# EAGLE design piezo-preamp-tickler_V0-5 (EAGLE 7.5.0)
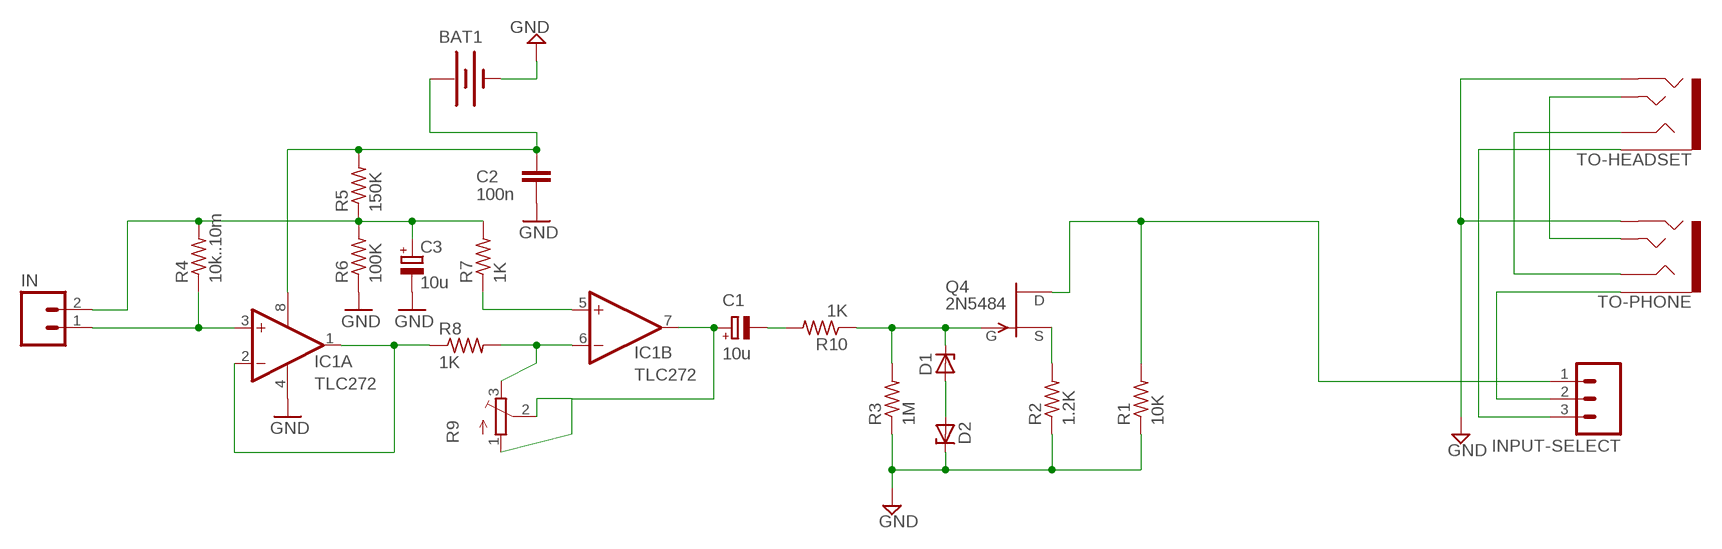
[diagram p0: schematic, sheet 1]

## Parts
BAT1  BATTERYA23  [BATTERY-A23]
C1  10u  CPOL-EUE2.5-5  [E2,5-5]
C2  100n  C-EU025-025X050  [C025-025X050]
C3  10u  CPOL-EUE2.5-5  [E2,5-5]
D1  1N821  [DO35Z10]
D2  1N821  [DO35Z10]
IC1  TLC272  TLC272P  [DIL08]
IN  M02LOCK  [1X02_LOCK]
INPUT-SELECT  M03LOCK  [1X03_LOCK]
Q4  2N5484  [TO92-]
R1  10K  R-US_0204/2V  [0204V]
R2  1.2K  R-US_0204/2V  [0204V]
R3  1M  R-US_0204/2V  [0204V]
R4  10k..10m  R-US_0204/2V  [0204V]
R5  150K  R-US_0204/2V  [0204V]
R6  100K  R-US_0204/2V  [0204V]
R7  1K  R-US_0204/2V  [0204V]
R8  1K  R-US_0204/2V  [0204V]
R9  TRIMPOT3386  [TRIM-3386]
R10  1K  R-US_0204/2V  [0204V]
TO-HEADSET  AUDIO-JACK3  [AUDIO-JACK-TRRS-SMD]
TO-PHONE  AUDIO-JACK3  [AUDIO-JACK-TRRS-SMD]

## Nets
`DEL: INPUT-SELECT.1 Q4.3(D) R1.2
GND: BAT1.GND@1(-) C2.1 C3.- D2.C IC1.4(P:V-) R1.1 R2.1 R3.1 R6.1 TO-HEADSET.RING2 TO-PHONE.RING2
N$1: D1.A D2.A
N$3: Q4.2(S) R2.2
N$5: IC1.5(B:+IN) R7.1
N$6: C1.+ IC1.7(B:OUT) R9.1(A) R9.2(S)
N$7: IC1.6(B:-IN) R8.2 R9.3(E)
N$8: C3.+ IN.2 R4.2 R5.1 R6.2 R7.2
N$9: IC1.3(A:+IN) IN.1 R4.1
N$10: D1.C Q4.1(G) R3.2 R10.1
N$11: C1.- R10.2
N$12: INPUT-SELECT.3 TO-HEADSET.EARTH
N$13: TO-HEADSET.TIP TO-PHONE.TIP
N$14: IC1.1(A:OUT) IC1.2(A:-IN) R8.1
N$15: TO-HEADSET.RING1 TO-PHONE.RING1
TO-PHONE: INPUT-SELECT.2 TO-PHONE.EARTH
V9V: BAT1.PWR@1(+) C2.2 IC1.8(P:V+) R5.2

## Library data of the parts
BAT1 = Daniel:BATTERY: Battery Holders Various common sizes : AA, AAA, 18650 (PRT-12895), 20mm coin cell and 12mm coin cell. 20MM_4LEGS, BATT-10373
C1 C3 = rcl:CPOL-EU: POLARIZED CAPACITOR, European symbol
C2 = rcl:C-EU: CAPACITOR, European symbol
D1 D2 = diode:1N821: Reference DIODE temperature compensated, 6,2 V
IC1 = linear:TLC272: OP AMP
IN = SparkFun-Connectors:M02: Header 2 Standard 2-pin 0.1" header. Use with straight break away headers (SKU : PRT-00116), right angle break away headers (PRT-00553), swiss pins (PRT-00743), machine pins (PRT-00117), and female headers (PRT-00115). Molex polarized connector foot print use with SKU : PRT-08233 with associated crimp pins and housings.
INPUT-SELECT = SparkFun-Connectors:M03: Header 3 Standard 3-pin 0.1" header. Use with straight break away headers (SKU : PRT-00116), right angle break away headers (PRT-00553), swiss pins (PRT-00743), machine pins (PRT-00117), and female headers (PRT-00115). Molex polarized connector foot print use with SKU : PRT-08232 with associated crimp pins and housings.
Q4 = transistor-fet:?548*: N-Channel JFETs Source: VISHAY 2N5484.pdf Compatible: TO92 2N5245 J304 J305 U310 J308 J309 J310 TO72 2N4416 2N4416A 2N3823 2N4351 3N169 3N170 3N171 MFE3002 TO18 2N3796 2N3797 MFE825 Source: Motorola European Master Guide Pacge 3-59
R1-R8 R10 = resistor:R-US_: RESISTOR, American symbol
R9 = adafruit:TRIMPOT: SMT trimmer potentiometer part number TC33X http://www.ladyada.net/library/eagle
TO-HEADSET TO-PHONE = SparkFun-Connectors:AUDIO-JACK3: Audio jack - 3.5mm TRRS variety - two rings.

## Net classes
0 default: width 0.6 mm, clearance 0.2 mm

## Board
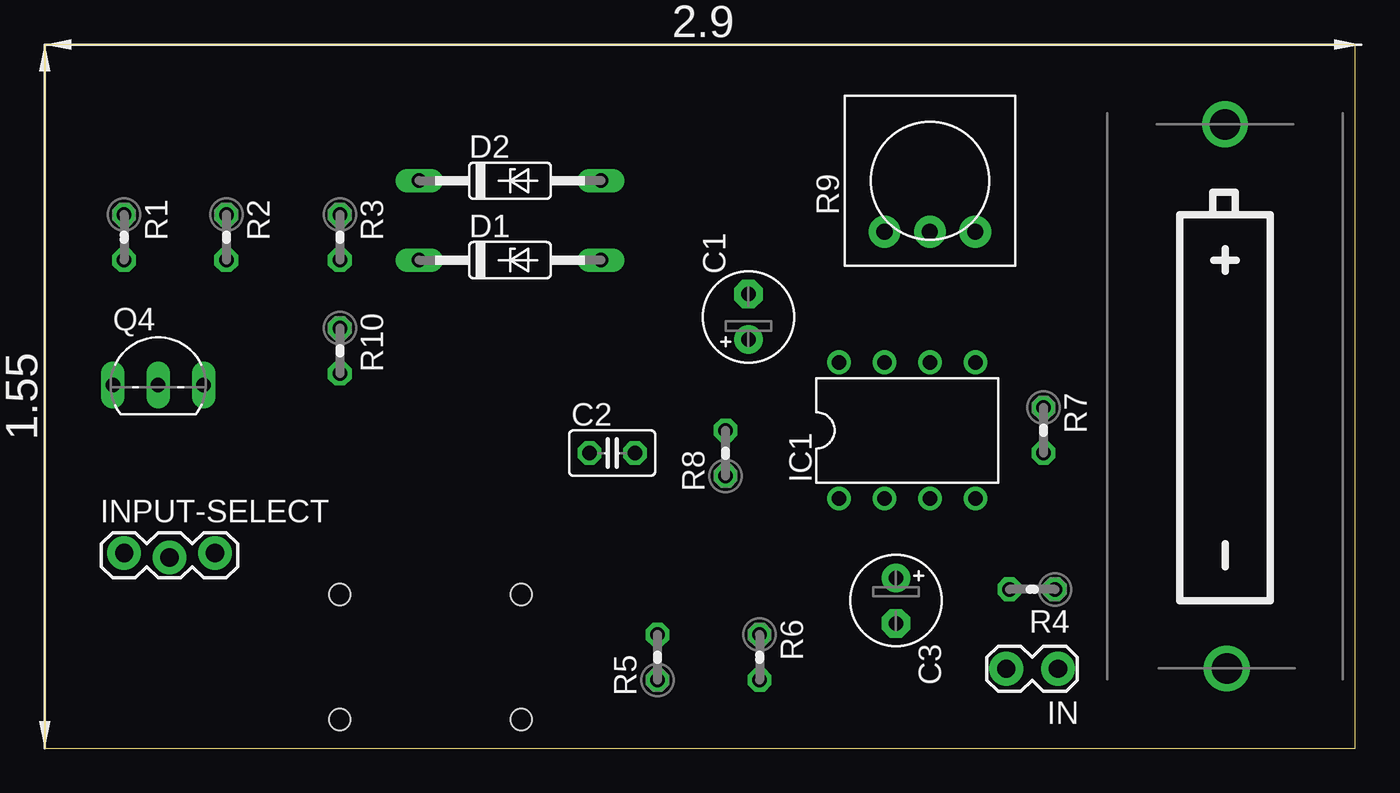
[diagram p1: board, top side]
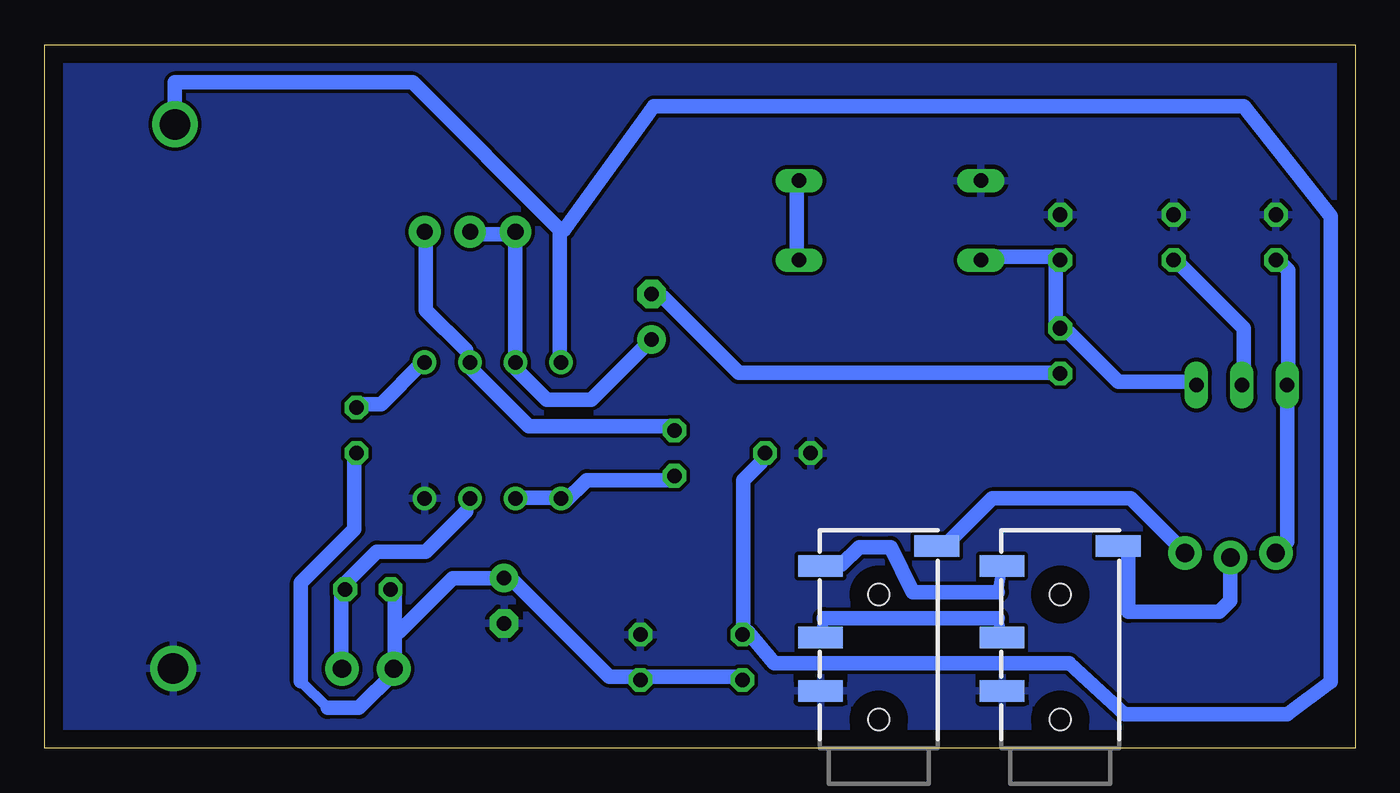
[diagram p2: board, bottom side, seen from below]

Size 73.33 x 39.36 mm. Coordinates in mm from the lower left corner, seen from the top.
Outline: 0,0 73.33,0 73.33,39.36 0,39.36 0,0
Copper layers (1*16): Top 0.035mm / dielectric 1.5mm / Bottom 0.035mm
Design rules "default *": minimum track width 10mil, minimum drill 24mil, track to track 8mil, track to pad 8mil, pad to pad 8mil, via to via 8mil, smd to smd 8mil, copper to edge 40mil, drill to drill 8mil, minimum pad ring 10mil, minimum via ring 8mil, stop-mask expansion 4mil, vias tented up to drill 0mil, thermal gap 10mil

### Footprints (pad centres in the part's own frame; a part is rotated, then mirrored left to right if it is on the bottom)
BATTERY-A23 = drill 1.702: GND@1 15.22,0.1; PWR@1 -15.22,0
E2,5-5 = drill 0.813 pad 1.6: + -1.27,0 | drill 0.813 pad 1.6 octagon: - 1.27,0
C025-025X050 = drill 0.813 octagon: 1 -1.27,0; 2 1.27,0
DO35Z10 = drill 0.813 long: A 5.08,0; C -5.08,0
DIL08 = drill 0.813 pad 1.27: 1 -3.81,-3.81; 2 -1.27,-3.81; 3 1.27,-3.81; 4 3.81,-3.81; 5 3.81,3.81; 6 1.27,3.81; 7 -1.27,3.81; 8 -3.81,3.81
1X02_LOCK = drill 1.016 pad 1.88: 1 -0.178,0; 2 2.718,0
1X03_LOCK = drill 1.016 pad 1.88: 1 0,0.127; 2 2.54,-0.127; 3 5.08,0.127
TO92- = drill 0.813 long: 1 2.54,0; 2 0,0; 3 -2.54,0
0204V = drill 0.813 octagon: 1 -1.27,0; 2 1.27,0
TRIM-3386 = drill 0.9 pad 1.778: 1 -2.54,-2.857; 2 0,-2.857; 3 2.54,-2.857
AUDIO-JACK-TRRS-SMD = smd 1.2 x 2.5: EARTH 11.3,-3.25; RING1 6.2,3.25; RING2 3.2,3.25; TIP 10.2,3.25 | hole 1.2: 1.6,0; 8.6,0

### Placement (x,y rotation side)
BAT1  66.04,19.68 270 top
C1  39.37,24.13 90 top
C2  31.75,16.51 0 top
C3  47.62,8.26 270 top
D1  26.04,27.3 0 top
D2  26.04,31.75 0 top
IC1  48.26,17.78 0 top
IN  56.52,4.45 180 top
INPUT-SELECT  4.45,10.79 0 top
Q4  6.35,20.32 0 top
R1  4.45,28.57 270 top
R2  10.16,28.57 270 top
R3  16.51,28.57 270 top
R4  55.24,8.89 180 top
R5  34.29,5.08 90 top
R6  40.01,5.08 270 top
R7  55.88,17.78 270 top
R8  38.1,16.51 90 top
R9  49.53,31.75 0 top
R10  16.51,22.23 270 top
TO-HEADSET  26.67,0 90 bottom
TO-PHONE  16.51,0 90 bottom

### Tracks (layer width: path | path; a pad name or v marks a point on that pad's centre or on a via)
`DEL
  Bottom 0.6: 3.75,20.5 Q4.3 | 4.25,27.25 R1.2
  Bottom 0.813: 3.75,20.5 3.75,26.75 4.25,27.25 | INPUT-SELECT.1 3.81,11.56 Q4.3
GND
  pour Bottom: 0,39.37 73.66,39.37 73.66,0 0,0
N$1
  Bottom 0.6: 31.25,27.5 D1.A | 31.25,31.75 D2.A
  Bottom 0.813: 31.25,31.75 31.25,27.5
N$3
  Bottom 0.6: 6.25,20.5 Q4.2 | 10,27.25 R2.2
  Bottom 0.813: 6.25,20.5 6.25,23.5 10,27.25
N$5
  Bottom 0.6: 52.25,21.5 IC1.5 | 55.75,19.25 R7.1
  Bottom 0.813: 52.25,21.5 54.5,19.25 55.75,19.25
N$6
  Bottom 0.6: 47,21.75 IC1.7 47.25,21.5 | 47,28.75 R9.1 47.25,28.75 | 39.5,22.75 C1.+ | 49.5,28.75 R9.2
  Bottom 0.813: 47,28.75 47,21.75 | 39.5,22.75 42.75,19.5 45.25,19.5 47.25,21.5 | 47.25,28.75 49.5,28.75
N$7
  Bottom 0.6: 49.75,21.75 49.75,22.25 | 52,28.75 R9.3
  Bottom 0.813: R8.2 38.25,18 46.25,18 49.75,21.5 IC1.6 49.75,21.75 | 52,28.75 52,24.5 49.75,22.25
N$8
  Bottom 0.6: 34.5,4 R5.1 | 40,4 R6.2 40.25,4 | 53.75,8.75 R4.2 | 53.75,4.5 IN.2 53.75,4.25 | 47.75,9.5 C3.+ 47.5,9.75 | 53.5,6.5 53.75,6.5 | 57.5,2.25 59,3.75 | 56,16.5 R7.2
  Bottom 0.813: 40,4 34.5,4 | 53.75,4.5 53.75,6.5 53.75,8.75 | 47.75,9.5 50.5,9.5 53.5,6.5 | 56,16.5 56,12.25 59,9.25 59,3.75 | 57.5,2.25 55.75,2.25 53.75,4.25 | 40.25,4 41.75,4 47.5,9.75
N$9
  Bottom 0.6: 56.75,8.75 R4.1 56.75,9 | 56.75,4.5 IN.1 | 49.75,13.25 49.75,13.75 IC1.3
  Bottom 0.813: 56.75,4.5 56.75,8.75 | 49.75,13.25 52,11 54.75,11 56.75,9
N$10
  Bottom 0.6: 9,20.5 Q4.1 | 16.5,23.25 R10.1 | 16.75,27.25 R3.2 16.75,27.5 | 20.75,27.5 D1.C
  Bottom 0.813: 9,20.5 13.25,20.5 16,23.25 16.5,23.25 | 16.75,27.25 16.75,23.5 R10.1 | 16.75,27.5 20.75,27.5
N$11
  Bottom 0.813: R10.2 16.75,21 34.5,21 38.75,25.25 39.25,25.25 C1.-
N$12
  Bottom 0.813: INPUT-SELECT.3 12.57,13.97 20.32,13.97 22.99,11.3 TO-HEADSET.EARTH
N$13
  Bottom 0.6: 29.75,10.25 28.75,10.25 | 20,8.73 TO-PHONE.TIP
  Bottom 0.813: 20,8.73 24.75,8.73 26,11.25 27.75,11.25 28.75,10.25 | 29.75,10.25 TO-HEADSET.TIP
N$14
  Bottom 0.6: 44.5,14 IC1.1 44.25,13.75 | 46.75,14 IC1.2 | 38.25,15 R8.1
  Bottom 0.813: 46.75,14 44.5,14 | 38.25,15 43,15 44.25,13.75
N$15
  Bottom 0.6: 20,7.27 TO-PHONE.RING1 | 29.75,7.27 TO-HEADSET.RING1
  Bottom 0.813: 29.75,7.27 20,7.27
TO-PHONE
  Bottom 0.6: 12.7,10.74 TO-PHONE.EARTH
  Bottom 0.813: INPUT-SELECT.2 6.99,8.26 7.62,7.62 12.7,7.62 12.7,10.74
V9V
  Bottom 0.6: 33.25,16 33.25,16.5 C2.2 | 34.25,6.5 R5.2 34,6.5 | 44.5,21.75 IC1.8 | 44.25,29 44.5,29
  Bottom 0.813: 34.25,6.5 34.25,15 33.25,16 | 44.5,21.75 44.5,29 52.75,37.25 66.04,37.25 BAT1.PWR@1 | 34,6.5 32.5,4.75 16,4.75 12.9,1.91 3.81,1.91 1.36,3.71 1.36,29.75 6.25,35.91 39.25,35.91 44.25,29